# EAGLE design v2164_quad_VC_mixer_0402 (EAGLE 7.7.0)
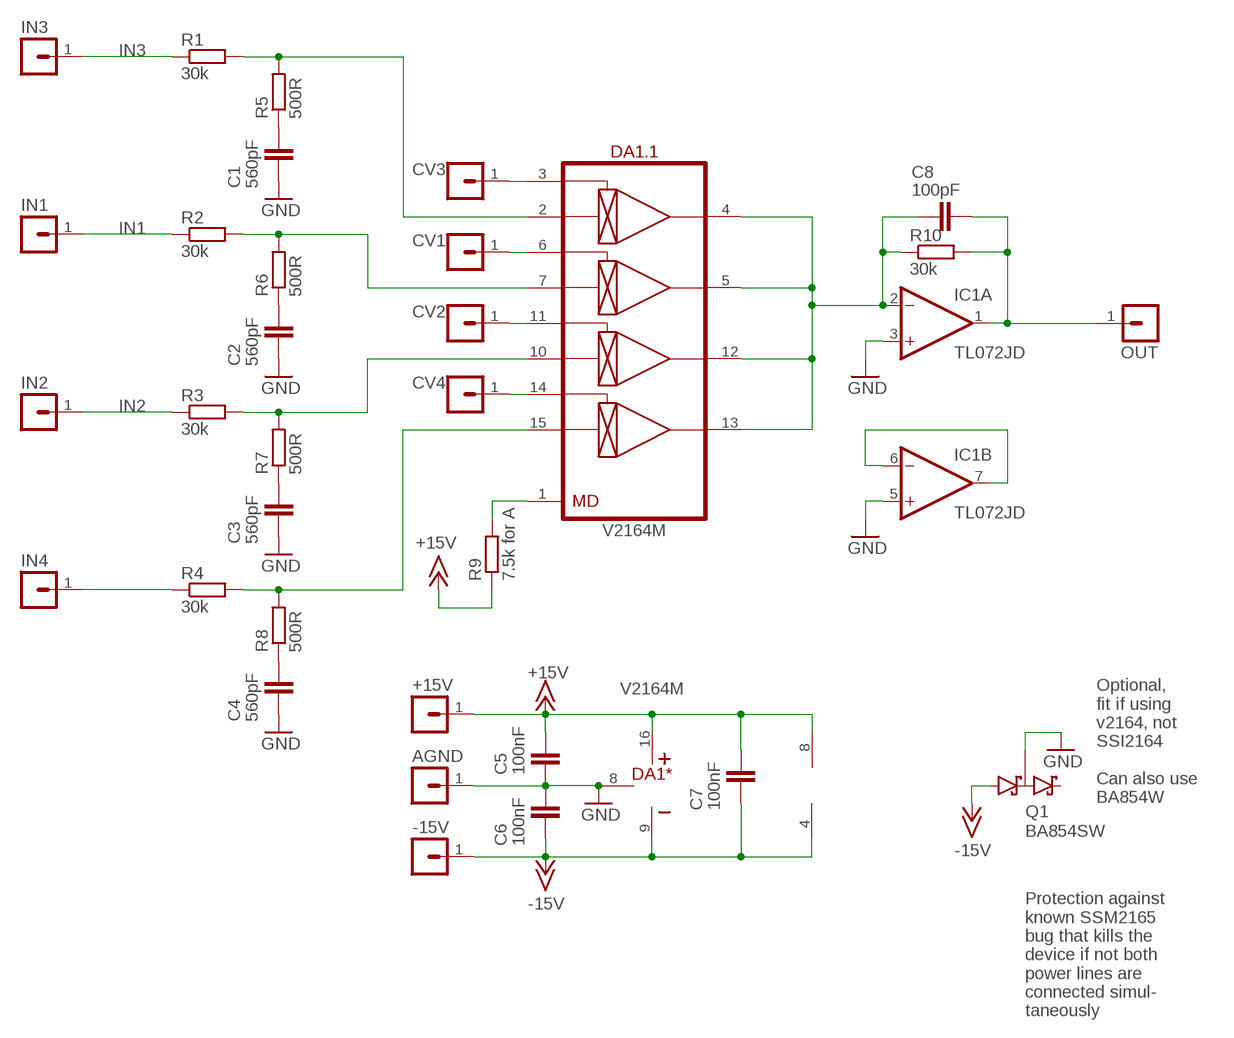
[diagram p0: schematic, sheet 1]

## Parts
+15V  MA01-1JN  [MA01N-1J]
-15V  MA01-1JN  [MA01N-1J]
AGND  MA01-1JN  [MA01N-1J]
C1  560pF  C-EUC0603  [C0603]
C2  560pF  C-EUC0603  [C0603]
C3  560pF  C-EUC0603  [C0603]
C4  560pF  C-EUC0603  [C0603]
C5  100nF  C-EUC0402  [C0402]
C6  100nF  C-EUC0402  [C0402]
C7  100nF  C-EUC0402  [C0402]
C8  100pF  C-EUC0402  [C0402]
CV1  MA01-1JN  [MA01N-1J]
CV2  MA01-1JN  [MA01N-1J]
CV3  MA01-1JN  [MA01N-1J]
CV4  MA01-1JN  [MA01N-1J]
DA1  V2164M  [SO-16]
IC1  TL072JD  [SO08J]
IN1  MA01-1JN  [MA01N-1J]
IN2  MA01-1JN  [MA01N-1J]
IN3  MA01-1JN  [MA01N-1J]
IN4  MA01-1JN  [MA01N-1J]
OUT  MA01-1JN  [MA01N-1J]
Q1  BA854SW  [SOT23-3J]
R1  30k  R-EU_R0402  [R0402]
R2  30k  R-EU_R0402  [R0402]
R3  30k  R-EU_R0402  [R0402]
R4  30k  R-EU_R0402  [R0402]
R5  500R  R-EU_R0402  [R0402]
R6  500R  R-EU_R0402  [R0402]
R7  500R  R-EU_R0402  [R0402]
R8  500R  R-EU_R0402  [R0402]
R9  7.5k for A  R-EU_R0402  [R0402]
R10  30k  R-EU_R0402  [R0402]

## Nets
+15V: +15V.1 C5.2 C7.2 DA1.16(*:V+) IC1.8(P:V+) R9.1
-15V: -15V.1 C6.1 C7.1 DA1.9(*:V-) IC1.4(P:V-) Q1.1(A1)
CV1: CV1.1 DA1.6(.1:CV2)
CV2: CV2.1 DA1.11(.1:CV3)
CV4: CV4.1 DA1.14(.1:CV4)
CV5: CV3.1 DA1.3(.1:CV1)
GND: AGND.1 C1.1 C2.1 C3.1 C4.1 C5.1 C6.2 DA1.8(*:GND) IC1.3(A:+IN) IC1.5(B:+IN) Q1.3(K1A2)
IN1: IN1.1 R2.1
IN2: IN2.1 R3.1
IN3: IN3.1 R1.1
IN4: IN4.1 R4.1
N$1: IC1.6(B:-IN) IC1.7(B:OUT)
N$2: DA1.1(.1:MD) R9.2
N$5: C8.1 DA1.4(.1:OUT1) DA1.5(.1:OUT2) DA1.12(.1:OUT3) DA1.13(.1:OUT4) IC1.2(A:-IN) R10.1
N$9: C1.2 R5.1
N$10: C2.2 R6.1
N$11: C3.2 R7.1
N$12: C4.2 R8.1
N$17: DA1.2(.1:IN1) R1.2 R5.2
N$18: DA1.7(.1:IN2) R2.2 R6.2
N$19: DA1.10(.1:IN3) R3.2 R7.2
N$20: DA1.15(.1:IN4) R4.2 R8.2
OUT: C8.2 IC1.1(A:OUT) OUT.1 R10.2
Unconnected: Q1.2(K2)

## Notes on the sheet
- Optional,
  fit if using
  v2164, not
  SSI2164
  
  Can also use
  BA854W
- Protection against
  known SSM2165
  bug that kills the
  device if not both
  power lines are 
  connected simul-
  taneously

## Library data of the parts
+15V -15V AGND CV1-CV4 IN1-IN4 OUT = joakim:MA01-1J: PIN HEADER
C1-C8 = rcl:C-EU: CAPACITOR, European symbol; SPICEPREFIX: C
DA1 = ic-coolaudio:V2164
IC1 = joakim:TL072J: OP AMP
Q1 = joakim:BA854SW: Shottky barrier dual diode
R1-R10 = rcl:R-EU_: RESISTOR, European symbol; SPICEPREFIX: R

## Board
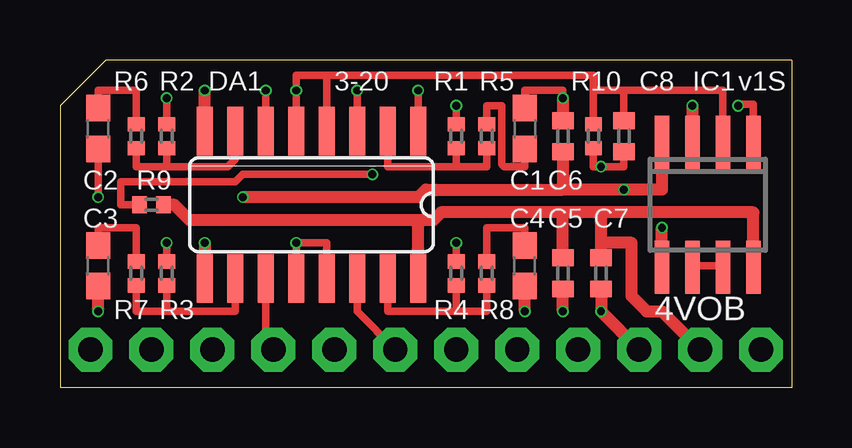
[diagram p1: board, top side]
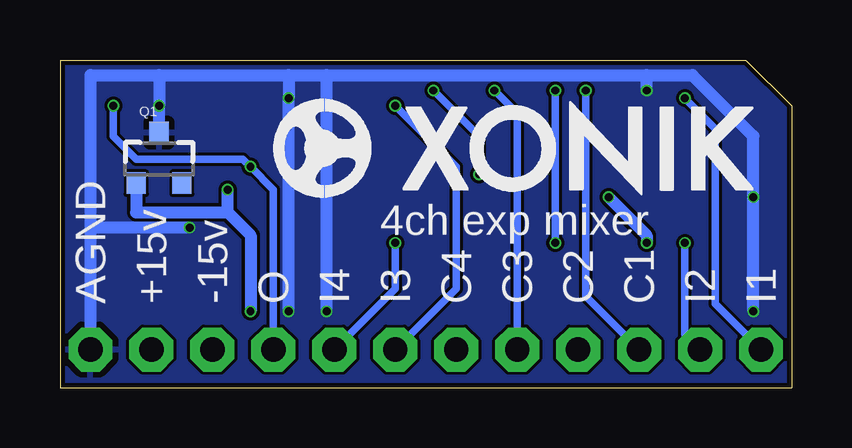
[diagram p2: board, bottom side, seen from below]

Size 30.48 x 13.65 mm. Coordinates in mm from the lower left corner, seen from the top.
Outline: 30.48,13.65 1.91,13.65 0,11.75 0,0 30.48,0 30.48,13.65
Copper layers (1*16): Top 0.035mm / dielectric 1.6mm / Bottom 0.035mm
Design rules "jlcpcb-2layers": minimum track width 5mil, minimum drill 0.3mm, track to track 5mil, track to pad 5mil, pad to pad 5mil, via to via 5mil, smd to smd 5mil, copper to edge 0.2mm, drill to drill 6mil, minimum pad ring 10mil, minimum via ring 3mil, stop-mask expansion 4mil, vias tented up to drill 0mil, thermal gap 10mil

### Footprints (pad centres in the part's own frame; a part is rotated, then mirrored left to right if it is on the bottom)
MA01N-1J = drill 1.016 octagon: 1 0,0
C0603 = smd 1.1 x 1: 1 -0.85,0; 2 0.85,0
C0402 = smd 0.7 x 0.9: 1 -0.65,0; 2 0.65,0
SO-16 = smd 0.66 x 2.032: 1 -4.445,-3.073; 2 -3.175,-3.073; 3 -1.905,-3.073; 4 -0.635,-3.073; 5 0.635,-3.073; 6 1.905,-3.073; 7 3.175,-3.073; 8 4.445,-3.073; 9 4.445,3.073; 10 3.175,3.073; 11 1.905,3.073; 12 0.635,3.073; 13 -0.635,3.073; 14 -1.905,3.073; 15 -3.175,3.073; 16 -4.445,3.073
SO08J = smd 0.6 x 2.2: 1 -1.905,-2.6; 2 -0.635,-2.6; 3 0.635,-2.6; 4 1.905,-2.6; 5 1.905,2.6; 6 0.635,2.6; 7 -0.635,2.6; 8 -1.905,2.6
SOT23-3J = smd 0.8 x 0.9: 1 -0.95,-1; 2 0.95,-1; 3 0,1.1
R0402 = smd 0.6 x 0.7: 1 -0.5,0; 2 0.5,0

### Placement (x,y rotation side)
+15V  26.67,1.59 90 top
-15V  24.13,1.59 90 top
AGND  29.21,1.59 90 top
C1  19.37,10.79 270 top
C2  1.59,10.79 90 top
C3  1.59,5.08 90 top
C4  19.37,5.08 90 top
C5  20.95,4.76 90 top
C6  20.95,10.48 90 top
C7  22.54,4.76 90 top
C8  23.5,10.48 270 top
CV1  6.35,1.59 90 top
CV2  8.89,1.59 90 top
CV3  11.43,1.59 90 top
CV4  13.97,1.59 90 top
DA1  10.48,7.62 180 top
IC1  26.99,7.62 180 top
IN1  1.27,1.59 90 top
IN2  3.81,1.59 90 top
IN3  16.51,1.59 90 top
IN4  19.05,1.59 90 top
OUT  21.59,1.59 90 top
Q1  26.35,9.53 0 bottom
R1  16.51,10.48 270 top
R2  4.45,10.48 270 top
R3  4.45,4.76 270 top
R4  16.51,4.76 270 top
R5  17.78,10.48 270 top
R6  3.17,10.48 270 top
R7  3.17,4.76 270 top
R8  17.78,4.76 270 top
R9  3.81,7.62 180 top
R10  22.23,10.48 270 top
U$1  [XONIK_LOGO_20]  21.59,7.94 0 bottom

### Tracks (layer width: path | path; a pad name or v marks a point on that pad's centre or on a via)
+15V
  Top 0.508: 22.54,7.3 28.89,7.3 IC1.8 | 22.54,7.3 20.95,7.3 | 20.95,7.3 15.88,7.3 15.56,6.99 14.92,6.99 | C5.2 20.95,7.3 | DA1.16 14.92,6.99 | C7.2 22.54,6.03 | 22.54,6.03 22.54,7.3 | R9.1 4.76,7.62 5.4,6.99 14.92,6.99 | +15V.1 25.08,3.17 24.45,3.17 23.81,3.81 23.81,6.03 22.54,6.03
-15V  (via drill 0.33)
  Top 0.508: IC1.4 25.08,8.26 v23.5,8.26 20.95,8.26 | 20.95,8.26 15.24,8.26 14.92,7.94 v7.62,7.94 | C6.1 20.95,8.26 | C7.1 v22.54,3.17 -15V.1 | v6.03,6.03 DA1.9
  Bottom 0.508: 23.5,7.3 22.54,6.35 v22.54,3.17 | v7.62,7.94 6.03,6.35 v6.03,6.03 | Q1.1 27.3,7.3 23.5,7.3 | 23.5,7.3 v23.5,8.26
CV1  (via drill 0.33)
  Top 0.305: DA1.6 v8.57,12.38
  Bottom 0.305: v8.57,12.38 8.57,3.81 CV1.1
CV2
  Top 0.305: CV2.1 8.57,1.91 DA1.11
CV4
  Top 0.305: DA1.14 12.38,3.17 CV4.1
CV5  (via drill 0.33)
  Top 0.305: DA1.3 v12.38,12.38
  Bottom 0.305: v12.38,12.38 11.43,11.43 CV3.1
GND  (via drill 0.33)
  Top 0.305: C2.1 v1.59,7.94 | C1.1 19.37,12.38 20.95,12.38 v20.95,12.06
  Top 0.508: DA1.8 v6.03,12.38 | v20.95,12.06 C6.2 | v26.35,11.75 IC1.3 | v1.59,3.17 C3.1 | v19.37,3.17 C4.1 | v20.95,3.17 C5.1 | IC1.5 v25.08,6.67
  Bottom 0.508: 26.35,13.02 29.21,13.02 29.21,6.67 | 26.35,13.02 20.95,13.02 | 20.95,13.02 19.37,13.02 | 19.37,13.02 6.03,13.02 | 6.03,13.02 4.13,13.02 1.59,10.48 v1.59,7.94 v1.59,3.17 | v6.03,12.38 6.03,13.02 | 20.95,13.02 v20.95,12.06 v20.95,3.17 | 26.35,13.02 v26.35,11.75 Q1.3 | v19.37,3.17 19.37,13.02 | 29.21,6.67 AGND.1 | v25.08,6.67 29.21,6.67
  pour Bottom: 0,0 0,13.65 30.48,13.65 30.48,0
IN1  (via drill 0.33)
  Top 0.305: R2.1 v4.45,12.06
  Bottom 0.305: v4.45,12.06 3.17,10.79 3.17,3.49 IN1.1
IN2  (via drill 0.33)
  Top 0.305: R3.1 v4.45,6.03
  Bottom 0.305: v4.45,6.03 4.45,2.22 IN2.1
IN3  (via drill 0.33)
  Top 0.305: R1.1 v16.51,11.75
  Bottom 0.305: v16.51,11.75 13.97,9.21 13.97,4.13 IN3.1
IN4  (via drill 0.33)
  Top 0.305: R4.1 v16.51,6.03
  Bottom 0.305: IN4.1 16.51,4.13 v16.51,6.03
N$1
  Top 0.305: IC1.6 26.35,5.08 27.62,5.08 IC1.7
N$2  (via drill 0.33)
  Top 0.305: R9.2 2.54,7.62 2.54,8.57 7.3,8.57 7.62,8.89 v13.02,8.89 | v14.92,12.38 DA1.1
  Bottom 0.305: v13.02,8.89 13.02,10.48 v14.92,12.38
N$5  (via drill 0.33)
  Top 0.305: 23.5,12.38 22.23,12.38 | 22.23,12.38 R10.1 | C8.1 23.5,12.38 | IC1.2 27.62,12.38 23.5,12.38 | DA1.4 11.11,13.02 | 11.11,13.02 22.23,13.02 22.23,12.38 | 11.11,13.02 9.84,13.02 DA1.5 v9.84,12.38 | DA1.12 v9.84,6.03 11.11,6.03 DA1.13
  Bottom 0.305: v9.84,12.38 v9.84,6.03
N$9
  Top 0.305: R5.1 17.78,11.75 18.41,11.75 18.41,9.31 18.52,9.21 19.37,9.21 C1.2
N$10
  Top 0.305: C2.2 1.59,12.38 3.17,12.38 R6.1
N$11
  Top 0.305: R7.1 3.17,6.67 1.59,6.67 C3.2
N$12
  Top 0.305: C4.2 19.37,6.67 17.78,6.67 R8.1
N$17
  Top 0.305: DA1.2 13.65,9.21 16.51,9.21 | R5.2 17.78,9.21 16.51,9.21 | 16.51,9.21 R1.2
N$18
  Top 0.305: R6.2 3.17,9.21 4.45,9.21 | 4.45,9.21 R2.2 | 4.45,9.21 6.99,9.21 7.3,9.53 DA1.7
N$19
  Top 0.305: R7.2 3.17,3.17 4.45,3.17 | 4.45,3.17 7.3,3.17 DA1.10 | R3.2 4.45,3.17
N$20
  Top 0.305: R8.2 17.78,3.17 16.51,3.17 | 16.51,3.17 13.65,3.17 DA1.15 | R4.2 16.51,3.17
OUT  (via drill 0.33)
  Top 0.305: R10.2 22.23,9.21 v22.54,9.21 23.5,9.21 C8.2 | IC1.1 28.89,11.81 28.32,11.81 v28.26,11.75
  Bottom 0.305: v28.26,11.75 28.26,10.48 27.3,9.53 22.86,9.53 v22.54,9.21 21.59,8.26 OUT.1

### Text on the board
tNames: 3-20 | v1S | 4VOB
bNames: 4ch exp mixer | I1 | I2 | C1 | C2 | C3 | C4 | I3 | I4 | O | -15v | +15v | AGND